# Altium schematic sheet MidADC.SchDoc
size A4
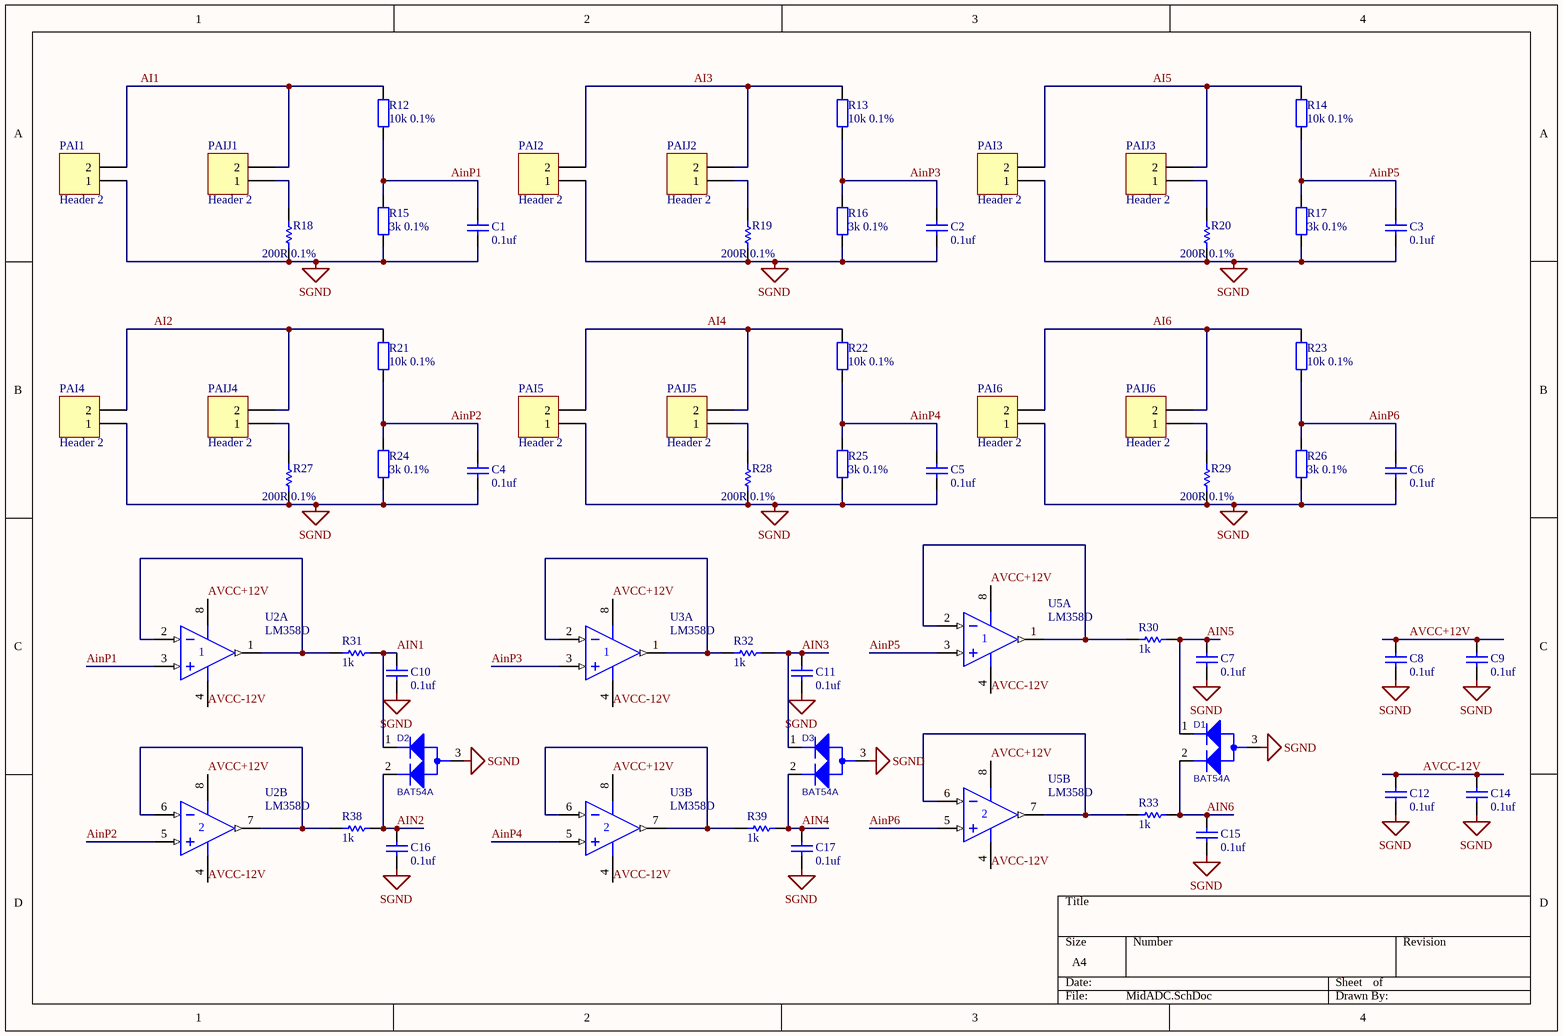
[diagram p0: MidADC.SchDoc]

## Parts
C1  value 0.1uf  [C0805]  (hidden comment: Cap)
C2  value 0.1uf  [C0805]  (hidden comment: Cap)
C3  value 0.1uf  [C0805]  (hidden comment: Cap)
C4  value 0.1uf  [C0805]  (hidden comment: Cap)
C5  value 0.1uf  [C0805]  (hidden comment: Cap)
C6  value 0.1uf  [C0805]  (hidden comment: Cap)
C7  value 0.1uf  [C0805]  (hidden comment: Cap)
C8  value 0.1uf  [C0805]  (hidden comment: Cap)
C9  value 0.1uf  [C0805]  (hidden comment: Cap)
C10  value 0.1uf  [C0805]  (hidden comment: Cap)
C11  value 0.1uf  [C0805]  (hidden comment: Cap)
C12  value 0.1uf  [C0805]  (hidden comment: Cap)
C14  value 0.1uf  [C0805]  (hidden comment: Cap)
C15  value 0.1uf  [C0805]  (hidden comment: Cap)
C16  value 0.1uf  [C0805]  (hidden comment: Cap)
C17  value 0.1uf  [C0805]  (hidden comment: Cap)
D1  BAT54A  [SOT23]
D2  BAT54A  [SOT23]
D3  BAT54A  [SOT23]
PAI1  Header 2  [3.5-P2]
PAI2  Header 2  [3.5-P2]
PAI3  Header 2  [3.5-P2]
PAI4  Header 2  [3.5-P2]
PAI5  Header 2  [3.5-P2]
PAI6  Header 2  [3.5-P2]
PAIJ1  Header 2  [HDR1X2]
PAIJ2  Header 2  [HDR1X2]
PAIJ3  Header 2  [HDR1X2]
PAIJ4  Header 2  [HDR1X2]
PAIJ5  Header 2  [HDR1X2]
PAIJ6  Header 2  [HDR1X2]
R12  value 10k 0.1%  [0805]  (hidden comment: Res2)
R13  value 10k 0.1%  [0805]  (hidden comment: Res2)
R14  value 10k 0.1%  [0805]  (hidden comment: Res2)
R15  value 3k 0.1%  [0805]  (hidden comment: Res2)
R16  value 3k 0.1%  [0805]  (hidden comment: Res2)
R17  value 3k 0.1%  [0805]  (hidden comment: Res2)
R18  value 200R 0.1%  [0805]  (hidden comment: Res Semi)
R19  value 200R 0.1%  [0805]  (hidden comment: Res Semi)
R20  value 200R 0.1%  [0805]  (hidden comment: Res Semi)
R21  value 10k 0.1%  [0805]  (hidden comment: Res2)
R22  value 10k 0.1%  [0805]  (hidden comment: Res2)
R23  value 10k 0.1%  [0805]  (hidden comment: Res2)
R24  value 3k 0.1%  [0805]  (hidden comment: Res2)
R25  value 3k 0.1%  [0805]  (hidden comment: Res2)
R26  value 3k 0.1%  [0805]  (hidden comment: Res2)
R27  value 200R 0.1%  [0805]  (hidden comment: Res Semi)
R28  value 200R 0.1%  [0805]  (hidden comment: Res Semi)
R29  value 200R 0.1%  [0805]  (hidden comment: Res Semi)
R30  value 1k  [0805]  (hidden comment: Res Semi)
R31  value 1k  [0805]  (hidden comment: Res Semi)
R32  value 1k  [0805]  (hidden comment: Res Semi)
R33  value 1k  [0805]  (hidden comment: Res Semi)
R38  value 1k  [0805]  (hidden comment: Res Semi)
R39  value 1k  [0805]  (hidden comment: Res Semi)
U2  LM358D  [751-02_N]  (parts A,B of 2)
U3  LM358D  [751-02_N]  (parts A,B of 2)
U5  LM358D  [751-02_N]  (parts A,B of 2)

## Nets
SGND: C1.2 C2.2 C3.2 C4.2 C5.2 C6.2 C7.2 C8.2 C9.2 C10.2 C11.2 C12.2 C14.2 C15.2 C16.2 C17.2 D1.3 D2.3 D3.3 PAI1.1 PAI2.1 PAI3.1 PAI4.1 PAI5.1 PAI6.1 R15.2 R16.2 R17.2 R18.2 R19.2 R20.2 R24.2 R25.2 R26.2 R27.2 R28.2 R29.2
AI1: PAI1.2 PAIJ1.2 R12.1
AI2: PAI4.2 PAIJ4.2 R21.1
AI3: PAI2.2 PAIJ2.2 R13.1
AI4: PAI5.2 PAIJ5.2 R22.1
AI5: PAI3.2 PAIJ3.2 R14.1
AI6: PAI6.2 PAIJ6.2 R23.1
AIN1: C10.1 D2.1 R31.2
AIN2: C16.1 D2.2 R38.2
AIN3: C11.1 D3.1 R32.2
AIN4: C17.1 D3.2 R39.2
AIN5: C7.1 D1.1 R30.2
AIN6: C15.1 D1.2 R33.2
AinP1: C1.1 R12.2 R15.1 U2.3(IN+)
AinP2: C4.1 R21.2 R24.1 U2.5(IN+)
AinP3: C2.1 R13.2 R16.1 U3.3(IN+)
AinP4: C5.1 R22.2 R25.1 U3.5(IN+)
AinP5: C3.1 R14.2 R17.1 U5.3(IN+)
AinP6: C6.1 R23.2 R26.1 U5.5(IN+)
AVCC+12V: C8.1 C9.1 U2.8(V+) U3.8(V+) U5.8(V+)
AVCC-12V: C12.1 C14.1 U2.4(V-) U3.4(V-) U5.4(V-)
NetPAIJ1_1: PAIJ1.1 R18.1
NetPAIJ2_1: PAIJ2.1 R19.1
NetPAIJ3_1: PAIJ3.1 R20.1
NetPAIJ4_1: PAIJ4.1 R27.1
NetPAIJ5_1: PAIJ5.1 R28.1
NetPAIJ6_1: PAIJ6.1 R29.1
NetR30_1: R30.1 U5.1(OUT) U5.2(IN-)
NetR31_1: R31.1 U2.1(OUT) U2.2(IN-)
NetR32_1: R32.1 U3.1(OUT) U3.2(IN-)
NetR33_1: R33.1 U5.6(IN-) U5.7(OUT)
NetR38_1: R38.1 U2.6(IN-) U2.7(OUT)
NetR39_1: R39.1 U3.6(IN-) U3.7(OUT)

## Library data of the parts
C1-C12 C14-C17 = Cap: Capacitor; Manufacturer: Generic Components; Class: Passive; Published: 08/06/2000; Publisher: Altium Hobart Technology Centre; SubClass: Capacitor
D1-D3 = BAT54A/SOT_2: PCB Footprint SMD: SMD; SMT: Y; TOLERANCE: =D22_TOLERANCE
PAI1-PAI6 PAIJ1-PAIJ6 = Header 2: Header, 2-Pin; LatestRevisionDate: 17-Jul-2002; LatestRevisionNote: Re-released for DXP Platform.; Publisher: Altium Limited
R12-R17 R21-R26 = RES
R18-R20 R27-R33 R38 R39 = Res Semi: Semiconductor Resistor; Published: 8-Jun-2000; LatestRevisionDate: 17-Jul-2002; LatestRevisionNote: Re-released for DXP Platform.; PackageReference: AXIAL-0.5; Publisher: Altium Limited
U2 U3 U5 = LM358D: Dual Low-Power Operational Amplifier; Published: 17-Jul-2002; LatestRevisionDate: 13-Apr-2006; LatestRevisionNote: IPC-7351 Footprint Added.; DatasheetVersion: 1988; PackageReference: 751-02; Publisher: Altium Limited; PackageDescription: 8-Pin Small Outline Integrated Circuit 1.27 mm Pitch; Code_JEDEC: MS-012-AA; Code_IPC: SOIC127P600-8; ComponentLink1Description: Manufacturer Link; ComponentLink1URL: http://www.onsemi.com/site/products/parametrics/0,4446,251,00.html; ComponentLink2Description: Datasheet; ComponentLink2URL: http://www.onsemi.com/pub/Collateral/LM358-D.PDF